# Altium schematic sheet Amp_op1.SchDoc: AmpOps de Potência
size A3; Address1: UFCG; Address2: Laboratório VIRTUS CC; Address3: Campina Grande, PB - Brasil; Revision: 01; SheetNumber: 4; SheetTotal: 8; Version: v1.0; Project: HAT RPi 4 - Phase Shifter Fotônico; SCH_SCALE: N/A; DocumentRev: 01
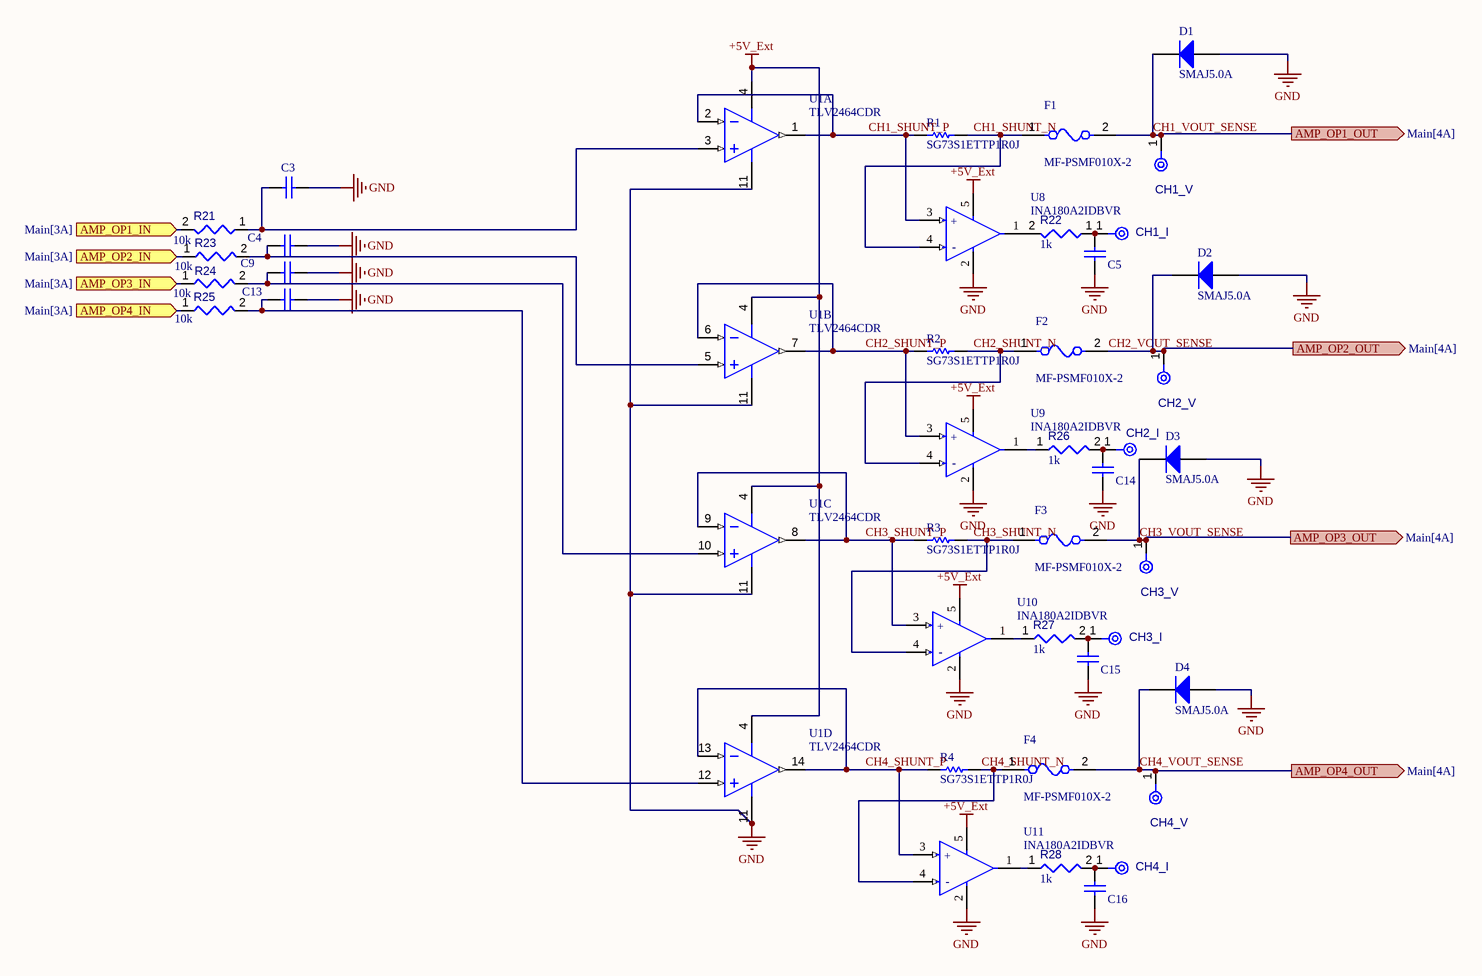
[diagram p0: Amp_op1.SchDoc]

## Parts
C3  VJ0603Y104MXJCW1BC  [CAPC1608X95X40NL15T15]  (value not drawn)
C4  VJ0603Y104MXJCW1BC  [CAPC1608X95X40NL15T15]  (value not drawn)
C5  VJ0603Y104MXJCW1BC  [CAPC1608X95X40NL15T15]  (value not drawn)
C9  VJ0603Y104MXJCW1BC  [CAPC1608X95X40NL15T15]  (value not drawn)
C13  VJ0603Y104MXJCW1BC  [CAPC1608X95X40NL15T15]  (value not drawn)
C14  VJ0603Y104MXJCW1BC  [CAPC1608X95X40NL15T15]  (value not drawn)
C15  VJ0603Y104MXJCW1BC  [CAPC1608X95X40NL15T15]  (value not drawn)
C16  VJ0603Y104MXJCW1BC  [CAPC1608X95X40NL15T15]  (value not drawn)
CH1_I  TPAD6R  [TP06R]  (value not drawn)  (no BOM)
CH1_V  TPAD6R  [TP06R]  (value not drawn)  (no BOM)
CH2_I  TPAD6R  [TP06R]  (value not drawn)  (no BOM)
CH2_V  TPAD6R  [TP06R]  (value not drawn)  (no BOM)
CH3_I  TPAD6R  [TP06R]  (value not drawn)  (no BOM)
CH3_V  TPAD6R  [TP06R]  (value not drawn)  (no BOM)
CH4_I  TPAD6R  [TP06R]  (value not drawn)  (no BOM)
CH4_V  TPAD6R  [TP06R]  (value not drawn)  (no BOM)
D1  SMAJ5.0A  [BOUR-SMA-2_V]
D2  SMAJ5.0A  [BOUR-SMA-2_V]
D3  SMAJ5.0A  [BOUR-SMA-2_V]
D4  SMAJ5.0A  [BOUR-SMA-2_V]
F1  MF-PSMF010X-2  [FP-MF-PSMF-MFG]
F2  MF-PSMF010X-2  [FP-MF-PSMF-MFG]
F3  MF-PSMF010X-2  [FP-MF-PSMF-MFG]
F4  MF-PSMF010X-2  [FP-MF-PSMF-MFG]
R1  SG73S1ETTP1R0J  [RESC1005X40X25LL10T10]
R2  SG73S1ETTP1R0J  [RESC1005X40X25LL10T10]
R3  SG73S1ETTP1R0J  [RESC1005X40X25LL10T10]
R4  SG73S1ETTP1R0J  [RESC1005X40X25LL10T10]
R21  value 10k  [RESC0603(1608)_L]  (hidden comment: Resistor 10k +/-1% 0603 100 mW)
R22  value 1k  [RESC0603(1608)_L]  (hidden comment: Resistor 1k +/-1% 0603 100 mW)
R23  value 10k  [RESC0603(1608)_L]  (hidden comment: Resistor 10k +/-1% 0603 100 mW)
R24  value 10k  [RESC0603(1608)_L]  (hidden comment: Resistor 10k +/-1% 0603 100 mW)
R25  value 10k  [RESC0603(1608)_L]  (hidden comment: Resistor 10k +/-1% 0603 100 mW)
R26  value 1k  [RESC0603(1608)_L]  (hidden comment: Resistor 1k +/-1% 0603 100 mW)
R27  value 1k  [RESC0603(1608)_L]  (hidden comment: Resistor 1k +/-1% 0603 100 mW)
R28  value 1k  [RESC0603(1608)_L]  (hidden comment: Resistor 1k +/-1% 0603 100 mW)
U1  TLV2464CDR  [D0014A_N]  (parts A,B,C,D of 4)
U8  INA180A2IDBVR  [FP-DBV0005A-MFG]
U9  INA180A2IDBVR  [FP-DBV0005A-MFG]
U10  INA180A2IDBVR  [FP-DBV0005A-MFG]
U11  INA180A2IDBVR  [FP-DBV0005A-MFG]

## Ports
AMP_OP1_IN (in, see Main[3A]), AMP_OP1_OUT (out, see Main[4A]), AMP_OP2_IN (in, see Main[3A]), AMP_OP2_OUT (out, see Main[4A]), AMP_OP3_IN (in, see Main[3A]), AMP_OP3_OUT (out, see Main[4A]), AMP_OP4_IN (in, see Main[3A]), AMP_OP4_OUT (out, see Main[4A])

## Nets
+5V_Ext: U1.4(VDD+) U8.5(VS) U9.5(VS) U10.5(VS) U11.5(VS)
GND: C3.2 C4.2 C5.1 C9.2 C13.2 C14.2 C15.2 C16.2 D1.1(A) D2.1(A) D3.1(A) D4.1(A) U1.11(GND) U8.2(GND) U9.2(GND) U10.2(GND) U11.2(GND)
AMP_OP1_IN: R21.2 ; port AMP_OP1_IN
AMP_OP2_IN: R23.1 ; port AMP_OP2_IN
AMP_OP3_IN: R24.1 ; port AMP_OP3_IN
AMP_OP4_IN: R25.1 ; port AMP_OP4_IN
CH1_SHUNT_N: F1.1 R1.2 U8.4(IN-)
CH1_SHUNT_P: R1.1 U1.1(OUT1) U1.2(IN1-) U8.3(IN+)
CH1_VOUT_SENSE: CH1_V.1(TP) D1.2(K) F1.2 ; port AMP_OP1_OUT
CH2_SHUNT_N: F2.1 R2.2 U9.4(IN-)
CH2_SHUNT_P: R2.1 U1.6(IN2-) U1.7(OUT2) U9.3(IN+)
CH2_VOUT_SENSE: CH2_V.1(TP) D2.2(K) F2.2 ; port AMP_OP2_OUT
CH3_SHUNT_N: F3.1 R3.2 U10.4(IN-)
CH3_SHUNT_P: R3.1 U1.8(OUT3) U1.9(IN3-) U10.3(IN+)
CH3_VOUT_SENSE: CH3_V.1(TP) D3.2(K) F3.2 ; port AMP_OP3_OUT
CH4_SHUNT_N: F4.1 R4.2 U11.4(IN-)
CH4_SHUNT_P: R4.1 U1.13(IN4-) U1.14(OUT4) U11.3(IN+)
CH4_VOUT_SENSE: CH4_V.1(TP) D4.2(K) F4.2 ; port AMP_OP4_OUT
NetC3_1: C3.1 R21.1 U1.3(IN1+)
NetC4_1: C4.1 R23.2 U1.5(IN2+)
NetC5_2: C5.2 CH1_I.1(TP) R22.1
NetC9_1: C9.1 R24.2 U1.10(IN3+)
NetC13_1: C13.1 R25.2 U1.12(IN4+)
NetC14_1: C14.1 CH2_I.1(TP) R26.2
NetC15_1: C15.1 CH3_I.1(TP) R27.2
NetC16_1: C16.1 CH4_I.1(TP) R28.2
NetR22_2: R22.2 U8.1(OUT)
NetR26_1: R26.1 U9.1(OUT)
NetR27_1: R27.1 U10.1(OUT)
NetR28_1: R28.1 U11.1(OUT)

## Notes on the sheet
- REVISION
- DESCRIPTION
- DATE
- APPROVED
- ADDRESS
- PROJECT
- VERSION
- TITLE
- A3
- SIZE
- SCALE
- DOCUMENT NAME:
- DOCUMENT REVISION:
- OF
- SHEET:
- PROJECT REVISION:
- (in symbol CMP-04895-000287-1) +; -

## Library data of the parts
C3-C5 C9 C13-C16 = CMP-2006-00058-1: Manufacturer: Vitramon; Part Number: VJ0603Y104MXJCW1BC
CH1_I CH1_V CH2_I CH2_V CH3_I CH3_V CH4_I CH4_V = CMP-00028-00002-2: 0.6mm round; Pins: 1; Component Type: Mechanical
D1-D4 = CMP-2000-07090-1: SMAJ Transient Voltage Suppressor Diode Series, 3.5 V, -55 to 150 degC, 2-Pin SMA, RoHS, Tape and Reel; Manufacturer: Bourns; EDA / CAD Models: DownloadfromAcceleratedDesigns; Unidirectional Channels: 1; Voltage - Breakdown (Min): 6.4V; Voltage - Reverse Standoff (Typ): 5V; Voltage - Clamping (Max) @ Ipp: 9.2V; Other Names: SMAJ5.0ABDKR; Type: Zener; Catalog Drawings: SMAJSeriesFootprintSMAJ,SMBJSeries; Featured Product: SMAJ/SMBJ/SMCJ/SMLJDiscreteTVSDiodes; Power - Peak Pulse: 400W; Current - Peak Pulse (10/1000µs): 43.5A; Power Line Protection: No; Online Catalog: SMAJSeries; Supplier Device Package: SMA(DO-214AC); Operating Temperature: -55°C~150°C(TJ); Package Description: 2-Pin Surface Mount Device, Body 4.315 x 2.605 mm; Datasheet URL: https://datasheet.ciiva.com/25624/0900766b8112213b-25624680.pdf; Manufacturer URL: http://www.bourns.com/; Datasheet Version: 08/2012; Series: SMAJ; Family: TVS-Diodes; Bidirectional Channels: -; Applications: GeneralPurpose; Package Reference: SMA-2; Standard Package: 1; Package / Case: DO-214AC,SMA; Category: CircuitProtection; RoHS Information: SMAJSeriesMaterialDeclaration; Mounting Technology: SurfaceMount; Capacitance @ Frequency: -; Packaging: Digi-Reel®; Mounting Type: SurfaceMount
F1-F4 = CMP-07400-000017-1: PTC RESET FUSE 15V 100MA 0805; Manufacturer: Bourns Inc.; Resistance: 1-7.5Ω; Value: 1-7.5Ω; Current Rating: 40A; Hold Current: 0.1A; Trip Current: 0.3A; Trip Time: 1.5s; Temperature: -40°C to +85°C; ComponentLink2Description: Datasheet; Lead Free: Yes; Ipc Land Pattern Name: CAPC215135X67; Device Class L1: Circuit Protection; Mouser Description: Resettable Fuses - PPTC 0.10A 15V 1ohm; Automotive: No; Octopart: https://octopart.com/mf-psmf010x-2-bourns-7483441; Manufacturer Part Number: MF-PSMF010X-2; RoHS: TRUE; Temperature Range High: +85°C; Digikey Description: PTC RESET FUSE 15V 100MA 0805; Device Class L3: unset; ComponentLink2URL: https://www.bourns.com/docs/Product-Datasheets/mfpsmf.pdf; Height: 0.85mm; Voltage Rating: 15V; Ambient Temperature Range Low: -40°C; Category: Fuse; Package: MF-PSMF; Temperature Range Low: -40°C; Device Class L2: PTC Resettable Fuses; Ambient Temperature Range High: +85°C
R1-R4 = CMP-2002-04124-1: Manufacturer: KOA Speer; Part Number: SG73S1ETTP1R0J
R21 R23-R25 = CMP-009-00017-7: Chip Resistor, 10 KOhm, +/- 1%, 01 W, -55 to 155 degC, 0603 (1608 Metric); Manufacturer: Yageo; Manufacturer Part Number: RC0603FR-0710KL; Manufacturer: Panasonic; Manufacturer Part Number: ERJ-3EKF1002V; Manufacturer Part Number: RC0603FR-1310KL; Manufacturer: Vishay; Manufacturer Part Number: CRCW060310K0FKEA; Voltage Rating: 50V; Power: 100mW; RoHS Compliant: True; Min Operating Temperature: -55°C; Pins: 2; Case/Package: 0603; Mounting Technology: SM; Max Operating Temperature: 155°C; Tolerance: 1%; Component Type: Resistors
R22 R26-R28 = CMP-009-00014-6: Chip Resistor, 1 KOhm, +/-1%, 0.1 W, -55 to 155 degC, 0603 (1608 Metric); Manufacturer: Yageo; Manufacturer Part Number: RC0603FR-071KL; Manufacturer: Panasonic; Manufacturer Part Number: ERJ-3EKF1001V; Manufacturer Part Number: RC0603FR-131KL; Power: 100mW; Tolerance: 1%; Voltage Rating: 50V; Mounting Technology: SM; Case/Package: 0603; Min Operating Temperature: -55°C; RoHS Compliant: True; Max Operating Temperature: 155°C; Pins: 2; Component Type: Resistors
U1 = CMP-0271-00006-3: Quad Low Power, Rail-to-Rail Input / Output Operational Amplifier, 2.7 to 6 V, 0 to 70 degC, 14-pin SOIC (D14), Green (RoHS & no Sb/Br); Manufacturer: Texas Instruments; Offset Drift(Typ)(uV/C): 2; Total Supply Voltage(Min)(+5V is 5, +/-5V is 10): 2.7; IIB(Max)(pA): 14000; CMRR(Min)(dB): 66; Iq per channel(Max)(mA): 0.575; Vn at 1kHz(Typ)(nV/rtHz): 11; Slew Rate(Typ)(V/us): 1.6; Number of Channels: 4; Sub Family: High Output Current Amplifier (>=50mA), Low Supply Voltage Amplifier (<=2.7V), Precision Amplifier; Total Supply Voltage(Max)(+5V is 5, +/-5V is 10): 6; ComponentLink3URL: http://www.ti.com/lit/ml/mpds177g/mpds177g.pdf; ComponentLink1Description: Manufacturer URL; PackageReference: D0014A; Vio (25C)(Max)(mV): 2; Mounting Technology: Surface Mount; PackageDescription: 14-Pin Plastic Small Outline, Body 8.65 x 3.9 mm, Pitch 1.27 mm; ComponentLink2Description: Datasheet; ComponentLink3Description: Package Specification; ComponentLink1URL: http://www.ti.com/; DatasheetVersion: SLOS220J; PartNumber: TLV2464CDR; Code_JEDEC: MS-012; PackageVersion: 4040047-5/M, 06/2011; ComponentLink2URL: http://www.ti.com/general/docs/lit/getliterature.tsp?genericPartNumber=TLV2464&fileType=pdf; Eco-Plan: Green (RoHS & no Sb/Br)
U8-U11 = CMP-04895-000287-1: IC CURR SENSE 1 CIRCUIT SOT23-5; Operating Supply Current: 260uA; -3db Bandwidth: 350kHz; Slew Rate: 2V/µs; Number of Circuits: 1; Input Offset Voltage (Vos): 100uV; Input Bias Current: 100nA; Mount: Surface Mount; Max Operating Temperature: 125°C; Packaging: Tape and Reel; Min Operating Temperature: -40°C; Case/Package: SOT-23-5; RoHS Compliant: Yes